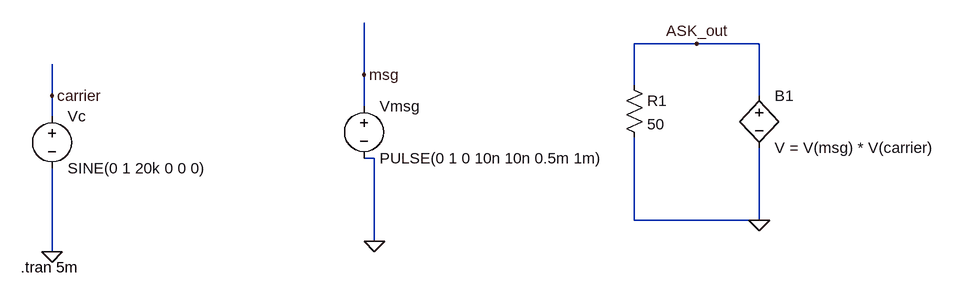
[diagram p0: schematic FTS_ASK.asc]
FTS_ASK.asc, the LTspice schematic file:
Version 4.1
SHEET 1 1484 680
WIRE 1088 -16 992 -16
WIRE 1184 -16 1088 -16
WIRE 576 32 576 -48
WIRE 992 48 992 -16
WIRE 96 64 96 16
WIRE 1184 64 1184 -16
WIRE 576 80 576 32
WIRE 96 96 96 64
WIRE 592 160 576 160
WIRE 992 256 992 128
WIRE 1184 256 1184 144
WIRE 1184 256 992 256
WIRE 592 288 592 160
WIRE 96 304 96 176
FLAG 96 304 0
FLAG 96 64 carrier
FLAG 592 288 0
FLAG 576 32 msg
FLAG 1184 256 0
FLAG 1088 -16 ASK_out
SYMBOL voltage 96 80 R0
WINDOW 123 0 0 Left 0
WINDOW 39 0 0 Left 0
SYMATTR InstName Vc
SYMATTR Value SINE(0 1 20k 0 0 0)
SYMBOL voltage 576 64 R0
WINDOW 123 0 0 Left 0
WINDOW 39 0 0 Left 0
SYMATTR InstName Vmsg
SYMATTR Value PULSE(0 1 0 10n 10n 0.5m 1m)
SYMBOL bv 1184 48 R0
SYMATTR InstName B1
SYMATTR Value V = V(msg) * V(carrier)
SYMBOL res 976 32 R0
SYMATTR InstName R1
SYMATTR Value 50
TEXT 48 328 Left 2 !.tran 5m

The netlist it stands for:
* FTS_ASK.asc
Vc carrier 0 SINE(0 1 20k 0 0 0)
Vmsg msg 0 PULSE(0 1 0 10n 10n 0.5m 1m)
B1 ASK_out 0 V = V(msg) * V(carrier)
R1 ASK_out 0 50
.tran 5m
.backanno
.end